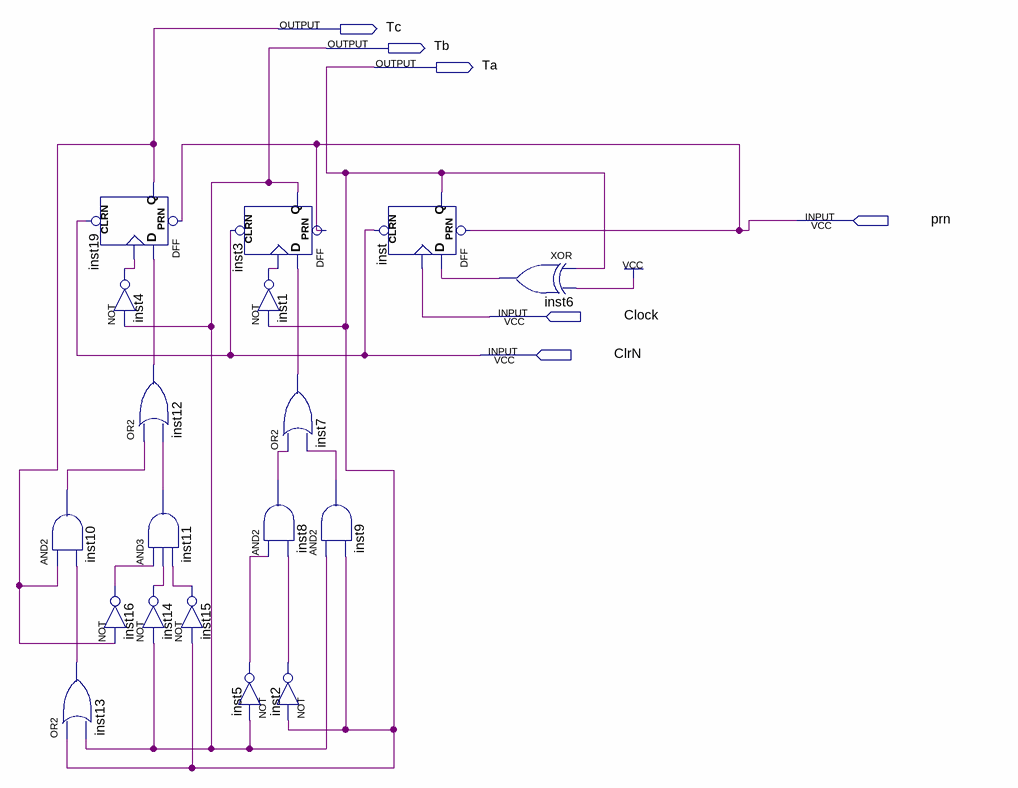
[diagram p0: schematic sheet]
// Quartus schematic TFFD.bdf as structural Verilog: 18 symbols, 6 pins
module TFFD (
  input  prn,
  input  Clock,
  input  ClrN,
  output Tc,
  output Tb,
  output Ta
);

  wire inst1_out, inst2_out, inst4_out, inst5_out, inst6_out, inst7_out, inst8_out, inst9_out, inst10_out,
       inst11_out, inst12_out, inst13_out, inst14_out, inst15_out, inst16_out;

  DFF inst19 (.CLRN(ClrN), .CLK(inst4_out), .D(inst12_out), .PRN(prn), .Q(Tc));
  and inst10 (inst10_out, Tc, inst13_out);
  not inst16 (inst16_out, Tc);
  or inst13 (inst13_out, Ta, Tb);
  not inst4 (inst4_out, Tb);
  or inst12 (inst12_out, inst10_out, inst11_out);
  and inst11 (inst11_out, inst16_out, inst14_out, inst15_out);
  not inst14 (inst14_out, Tb);
  not inst15 (inst15_out, Ta);
  DFF inst3 (.CLRN(ClrN), .CLK(inst1_out), .D(inst7_out), .PRN(prn), .Q(Tb));
  not inst1 (inst1_out, Ta);
  and inst8 (inst8_out, inst5_out, inst2_out);
  not inst5 (inst5_out, Tb);
  or inst7 (inst7_out, inst8_out, inst9_out);
  and inst9 (inst9_out, Tb, Ta);
  not inst2 (inst2_out, Ta);
  DFF inst (.CLRN(ClrN), .CLK(Clock), .D(inst6_out), .PRN(prn), .Q(Ta));
  xor inst6 (inst6_out, Ta, 1'b1);
endmodule
